# Altium schematic sheet Arduino-Pro-Mini.SchDoc: Arduino-Pro-Mini
size 270 x 207 mm; Date: 2015-11-11 8:06:48 PM; SheetNumber: 1
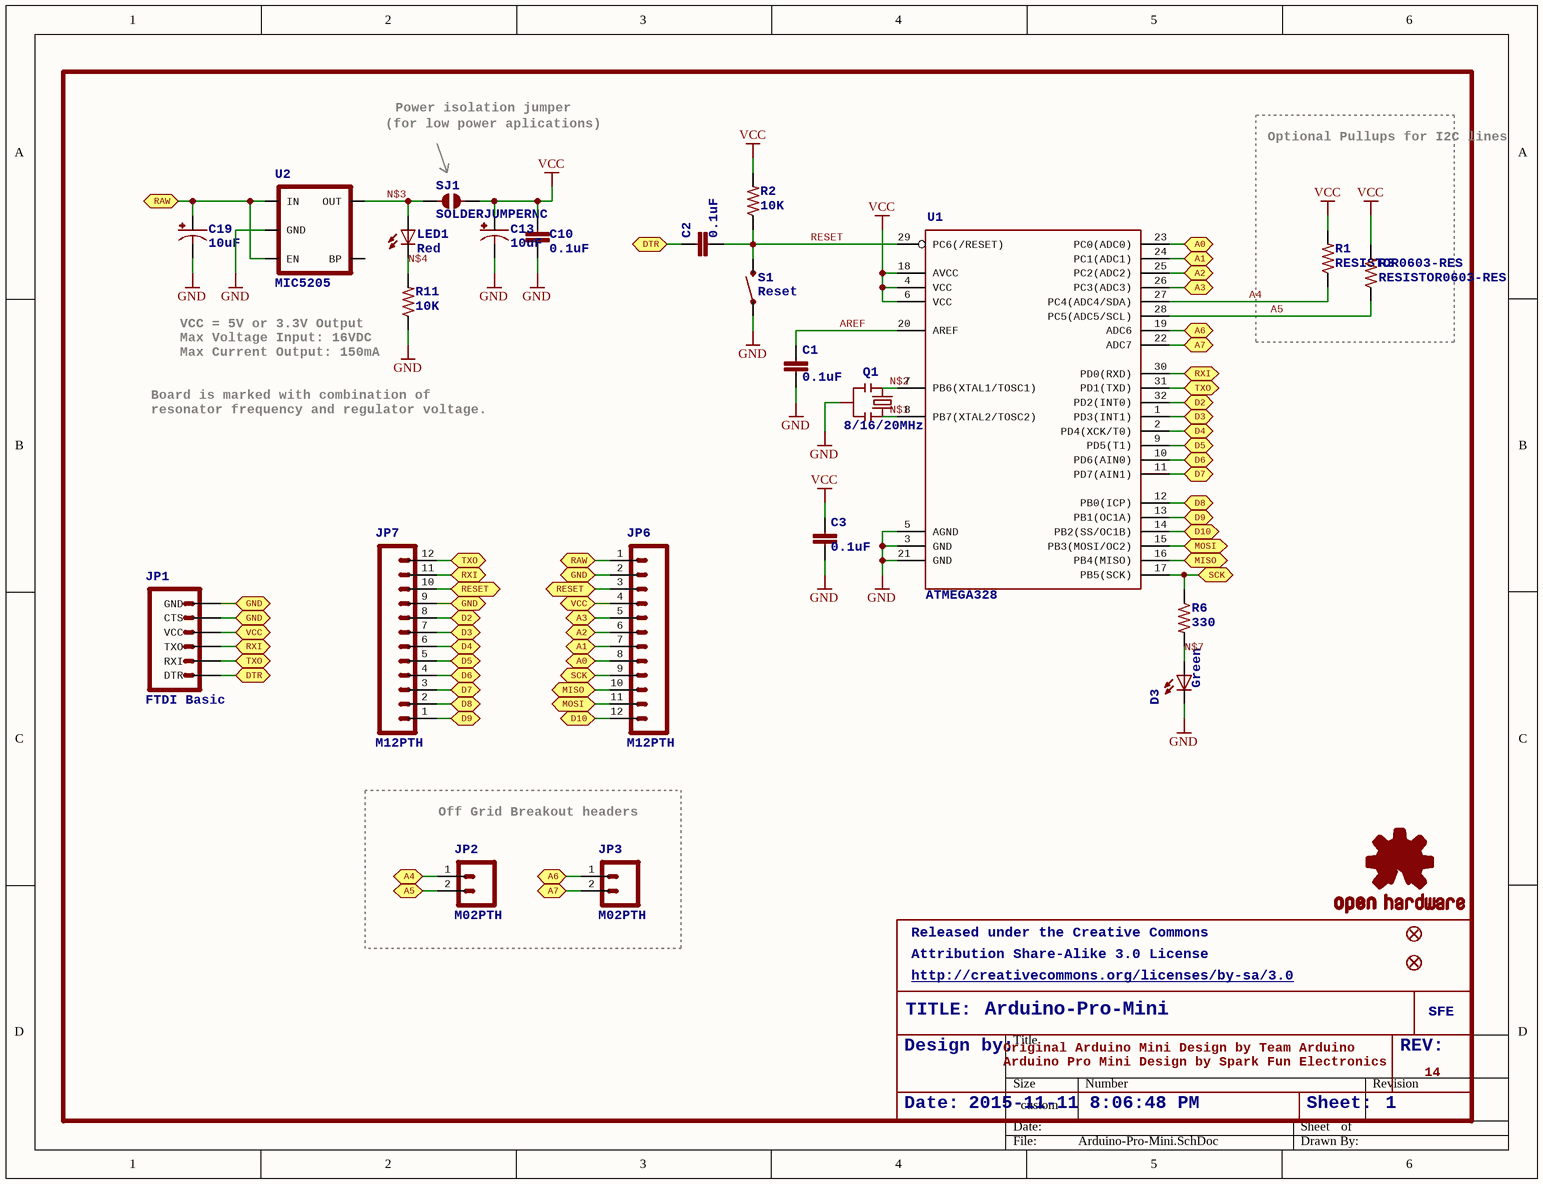
[diagram p0: Arduino-Pro-Mini.SchDoc]

## Parts
C1  0.1uF  [0603-CAP]
C2  0.1uF  [0603-CAP]
C3  0.1uF  [0603-CAP]
C10  0.1uF  [0603-CAP]
C13  10uF  [EIA3216]
C19  10uF  [EIA3216]
D3  Green  [0603-LED-ALT1]
JP1  FTDI Basic  [1X06]
JP2  M02PTH  [1X02]
JP3  M02PTH  [1X02]
JP5  FIDUCIALUFIDUCIAL  [MICRO-FIDUCIAL]  (value not drawn)
JP6  M12PTH  [1X12]
JP7  M12PTH  [1X12]
JP8  FIDUCIALUFIDUCIAL  [MICRO-FIDUCIAL]  (value not drawn)
LED1  Red  [0603-LED-ALT1]
Q1  8/16/20MHz  [RESONATOR-SMD-1:1]
R1  RESISTOR0603-RES  [0603-RES]
R2  10K  [0603-RES]
R3  RESISTOR0603-RES  [0603-RES]
R6  330  [0603-RES]
R11  10K  [0603-RES]
S1  Reset  [TACTILE-SWITCH-SMD-ALT01]
SJ1  SOLDERJUMPERNC  [SJ_2S]
U1  ATMEGA328  [TQFP32-08]
U2  MIC5205  [SOT23-5]
U$1  LOGO-SFESK  [SFE-LOGO-FLAME]  (value not drawn)
U$3  OSHW-LOGOS  [OSHW-LOGO-S]  (value not drawn)
U$11  LOGO-SFENEW  [SFE-NEW-WEBLOGO]  (value not drawn)

## Blocks framed on the sheet
Optional Pullups for I2C lines: R1 R3
Off Grid Breakout headers: JP2 JP3

## Ports
A0, A1, A2, A3, A4, A5, A6, A7, D2, D3, D4, D5, D6, D7, D8, D9, D10, DTR, GND, MISO, MOSI, RAW, RESET, RXI, SCK, TXO, VCC

## Nets
GND: C1.1 C3.1 C10.2 C13.C(-) C19.C(-) D3.C Q1.2 R11.1 S1.1_2 U1.3(GND) U1.5(AGND) U1.21(GND) U2.2(GND)
VCC: C3.2 C10.1 C13.A(+) R1.2 R2.2 R3.2 SJ1.2 U1.4(VCC) U1.6(VCC) U1.18(AVCC)
A0: JP6.8 U1.23(PC0(ADC0)) ; port A0
A1: JP6.7 U1.24(PC1(ADC1)) ; port A1
A2: JP6.6 U1.25(PC2(ADC2)) ; port A2
A3: JP6.5 U1.26(PC3(ADC3)) ; port A3
A4: JP2.1 ; port A4
A4: R1.1 U1.27(PC4(ADC4/SDA))  [a separate net that carries the same name]
A5: JP2.2 ; port A5
A5: R3.1 U1.28(PC5(ADC5/SCL))  [a separate net that carries the same name]
A6: JP3.1 U1.19(ADC6) ; port A6
A7: JP3.2 U1.22(ADC7) ; port A7
AREF: C1.2 U1.20(AREF)
D2: JP7.8 U1.32(PD2(INT0)) ; port D2
D3: JP7.7 U1.1(PD3(INT1)) ; port D3
D4: JP7.6 U1.2(PD4(XCK/T0)) ; port D4
D5: JP7.5 U1.9(PD5(T1)) ; port D5
D6: JP7.4 U1.10(PD6(AIN0)) ; port D6
D7: JP7.3 U1.11(PD7(AIN1)) ; port D7
D8: JP7.2 U1.12(PB0(ICP)) ; port D8
D9: JP7.1 U1.13(PB1(OC1A)) ; port D9
D10: JP6.12 U1.14(PB2(SS/OC1B)) ; port D10
DTR: C2.2 JP1.1(DTR) ; port DTR
GND: JP1.5(CTS) JP1.6(GND) JP6.2 JP7.9 ; port GND  [a separate net that carries the same name]
MISO: JP6.10 U1.16(PB4(MISO)) ; port MISO
MOSI: JP6.11 U1.15(PB3(MOSI/OC2)) ; port MOSI
N$1: Q1.3 U1.8(PB7(XTAL2/TOSC2))
N$2: Q1.1 U1.7(PB6(XTAL1/TOSC1))
N$3: LED1.A SJ1.1 U2.5(OUT)
N$4: LED1.C R11.2
N$7: D3.A R6.2
RAW: C19.A(+) JP6.1 U2.1(IN) U2.3(EN) ; port RAW
RESET: C2.1 R2.1 S1.3_4 U1.29(PC6(/RESET))
RESET: JP6.3 JP7.10 ; port RESET  [a separate net that carries the same name]
RXI: JP1.3(TXO) JP7.11 U1.30(PD0(RXD)) ; port RXI
SCK: JP6.9 R6.1 U1.17(PB5(SCK)) ; port SCK
TXO: JP1.2(RXI) JP7.12 U1.31(PD1(TXD)) ; port TXO
VCC: JP1.4(VCC) JP6.4 ; port VCC  [a separate net that carries the same name]

Not connected (* = marked no-connect by the designer): U2 4(BP)

## Notes on the sheet
- (for low power aplications)
- Power isolation jumper
- Max Voltage Input: 16VDC
- VCC = 5V or 3.3V Output
- Board is marked with combination of
- resonator frequency and regulator voltage.
- Max Current Output: 150mA
- Released under the Creative Commons
- Attribution Share-Alike 3.0 License
- http://creativecommons.org/licenses/by-sa/3.0
- Design by:
- TITLE:
- Original Arduino Mini Design by Team Arduino
- Arduino Pro Mini Design by Spark Fun Electronics
- REV:
- Date:
- Sheet:
- 14

## Library data of the parts
C1-C3 C10 = CAP0603-CAP: CapacitorStandard 0603 ceramic capacitor, and 0.1" leaded capacitor.
C13 C19 = CAP_POL1206: Capacitor PolarizedThese are standard SMD and PTH capacitors. Normally 10uF, 47uF, and 100uF in electrolytic and tantalum varieties. Always verify the external diameter of the through hole cap, it varies with capacity, voltage, and manufacturer. The EIA devices should be standard.
D3 LED1 = LED: LEDsStandard schematic elements and footprints for 5mm, 3mm, 1206, and 0603 sized LEDs. 5mm - Spark Fun Electronics SKU : COM-00529 (and others)
JP1 = ARDUINO_SERIAL_PROGRAMPTH
JP2 JP3 = M02PTH: Header 2Standard 2-pin 0.1" header. Use with straight break away headers (SKU : PRT-00116), right angle break away headers (PRT-00553), swiss pins (PRT-00743), machine pins (PRT-00117), and female headers (PRT-00115). Molex polarized connector foot print use with SKU : PRT-08233 with associated crimp pins and housings.
JP5 JP8 = FIDUCIALUFIDUCIAL: Fiducial Alignment PointsVarious fiducial points for machine vision alignment.
JP6 JP7 = M12PTH: Header 12Standard 12-pin 0.1" header. Use with straight break away headers (SKU : PRT-00116), right angle break away headers (PRT-00553), swiss pins (PRT-00743), machine pins (PRT-00117), and female headers (PRT-00115).
Q1 = RESONATOR1:1: ResonatorSmall SMD resonator. This is the itty bitty 10/20MHz resonators with built in caps. CSTCE10M0G55 and CSTCE20M0V53. Footprint for SMD has been used in SFE production for years, and does work okay. 1:1 is an attempt to get larger fillets on the sides so it will be easier to inspect these solders in our AOI machine. The pads have been minimized to match the actual metal under the resonator. To see this relation, it includes an image import of the bottom side of the component. Imported to scale on layer 200.
R1-R3 R6 R11 = RESISTOR0603-RES: ResistorBasic schematic elements and footprints for 0603, 1206, and PTH resistors.
S1 = SWITCH-MOMENTARY-2SMD-ALT01: Various NO switches- pushbuttons, reed, etc
SJ1 = SOLDERJUMPERNC: Solder JumperStandard SMD solder jumper. Used to automate production. Two varients : Normally Open and Normally Closed are the same, but have different paste layers. NC will have a large amount of paste and should jumper during reflow.
U1 = ATMEGA168
U2 = V_REG_LDOSMD: Voltage Regulator LDOStandard 150mA LDO voltage regulator in SOT-23 layout. Micrel part MIC5205. BP (by-pass) pin is used to lower output noise with 470pF cap.
U$1 = LOGO-SFESK: Spark Fun Electronics PCB LogoThis is the standard Spark Fun Electronics PCB logo.; SFE: SFE
U$3 = OSHW-LOGOS: Open Source Hardware Logo This logo indicates the piece of hardware it is found on incorporates a OSHW license and/or adheres to the definition of open source hardware found here: http://freedomdefined.org/OSHW
U$11 = LOGO-SFENEW: Spark Fun Electronics PCB LogoThis is the standard Spark Fun Electronics PCB logo.; SFE: SFE